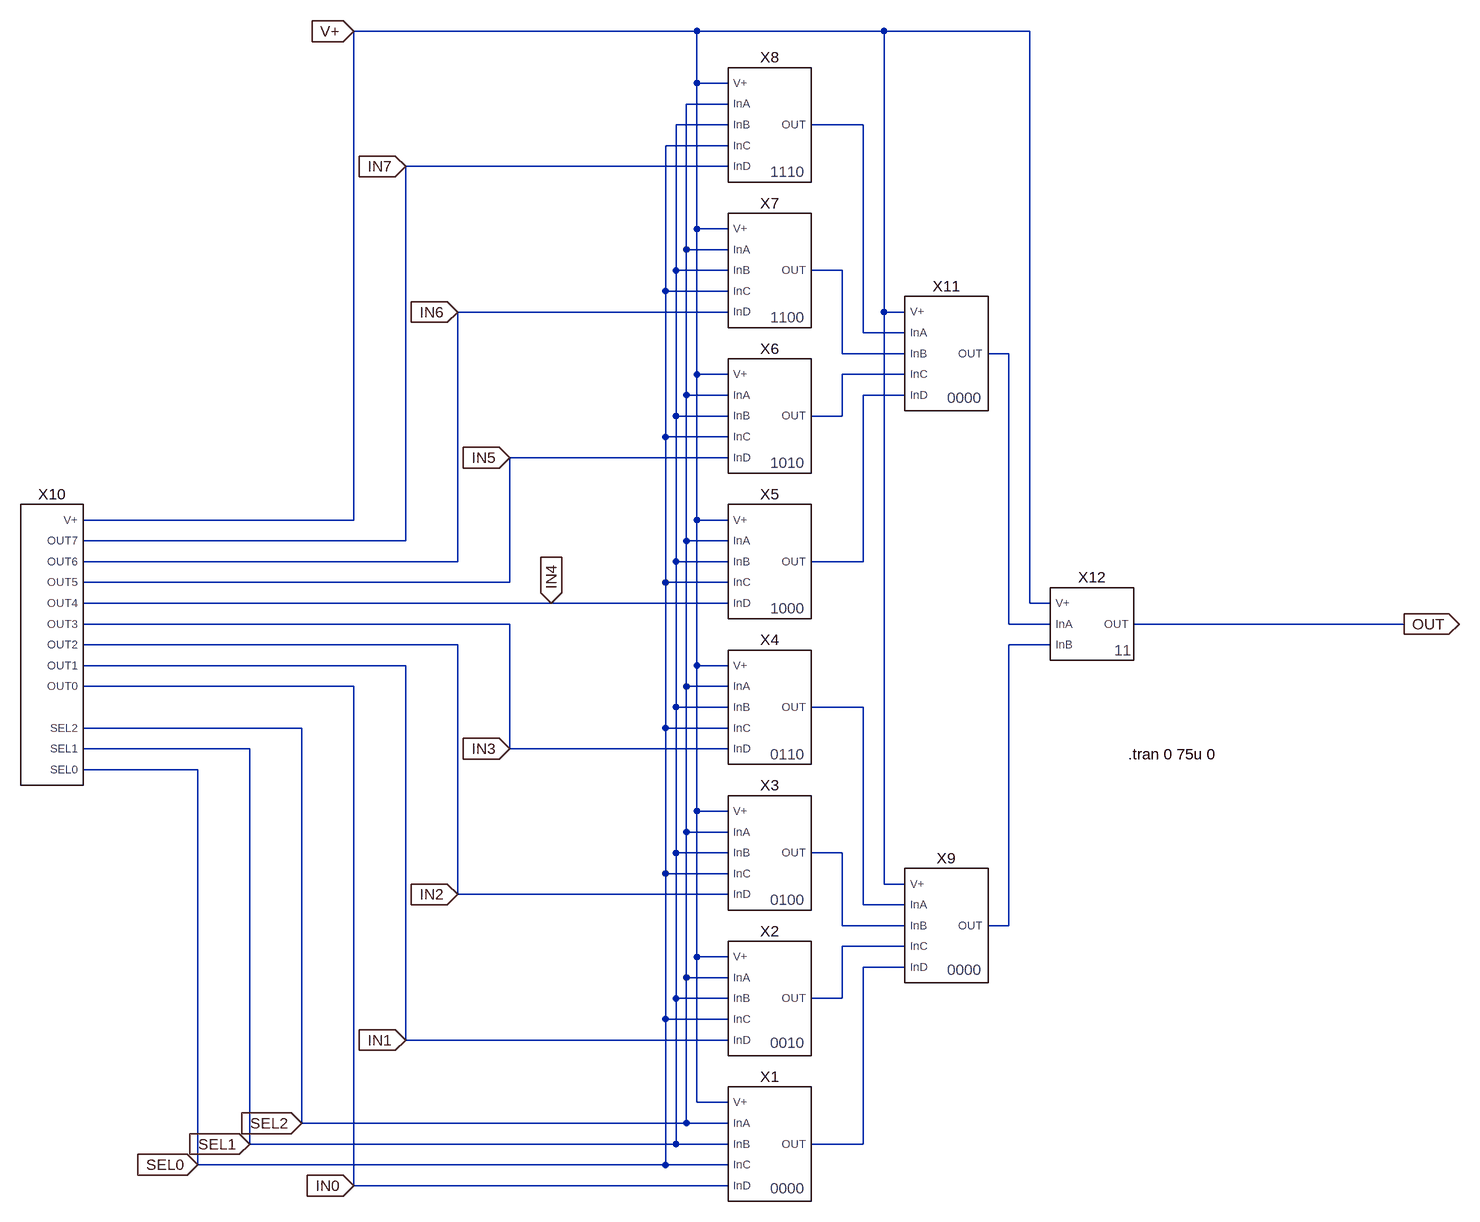
[diagram p0: schematic LUT-STIM.asc]
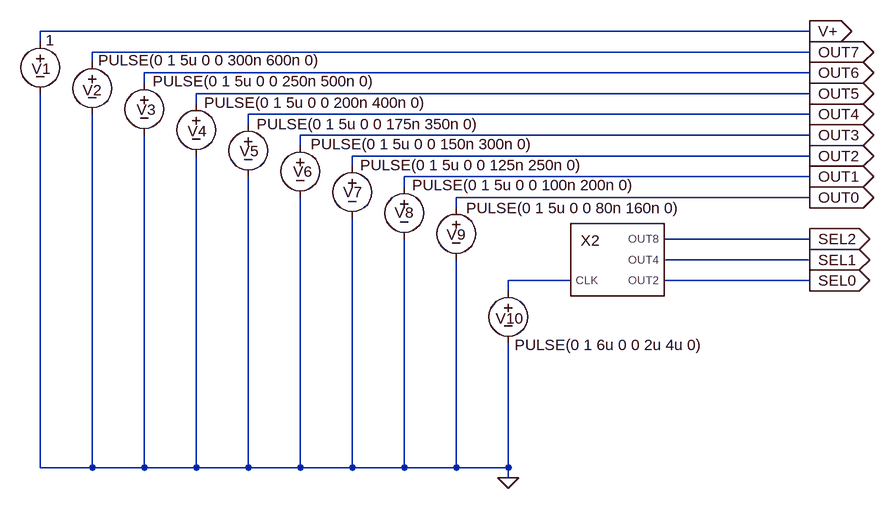
[diagram p1: sub-circuit stim.asc]
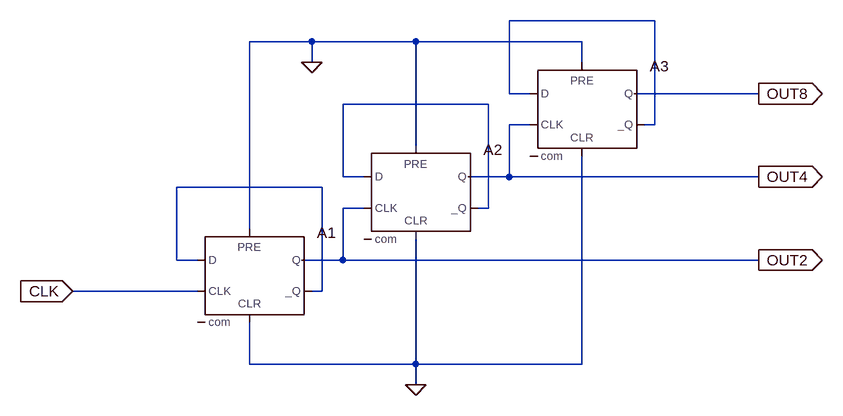
[diagram p2: sub-circuit div.asc]
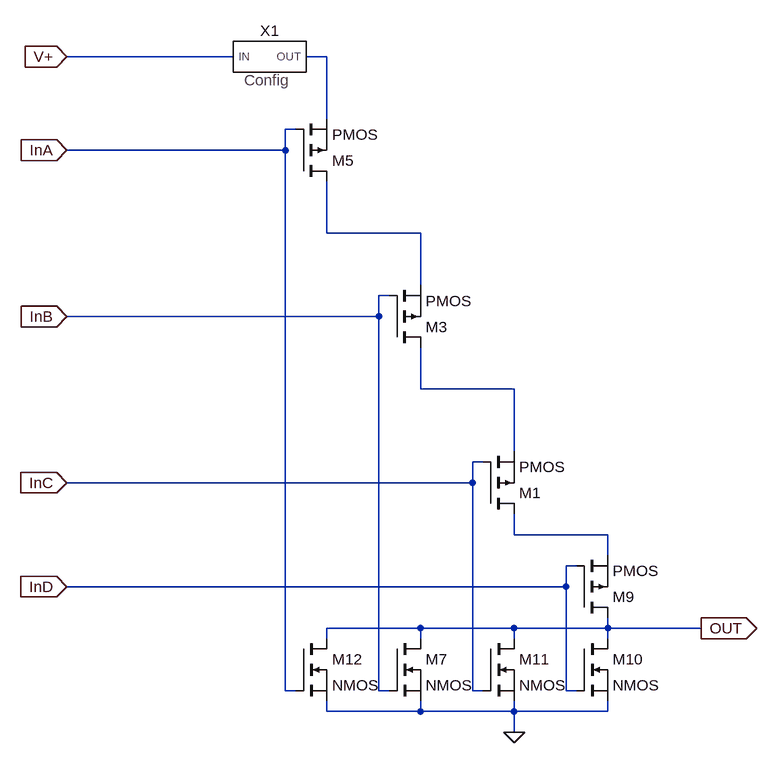
[diagram p3: sub-circuit 4-in-lut-0000.asc]
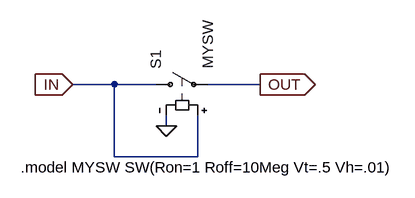
[diagram p4: sub-circuit config.asc]
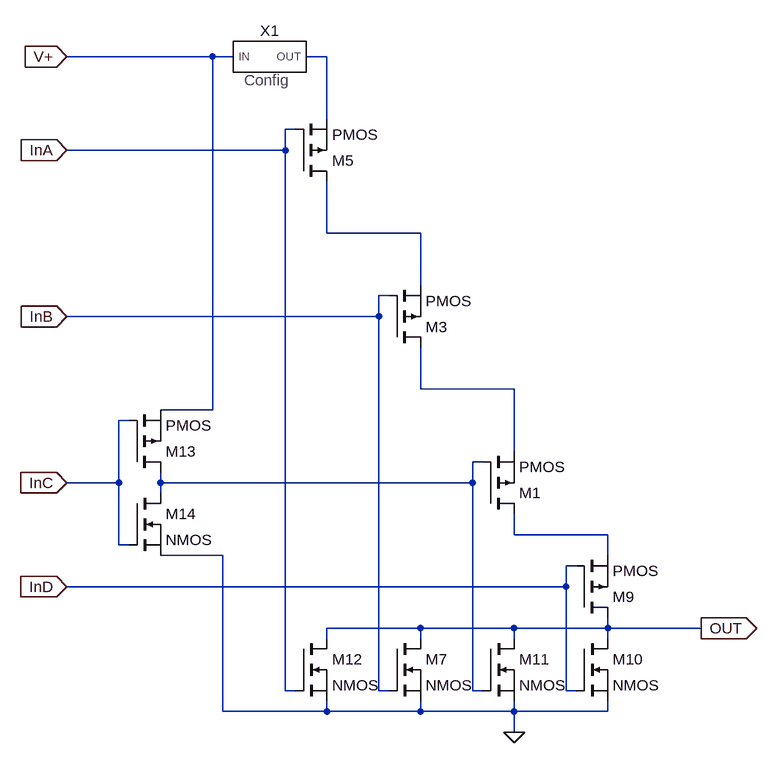
[diagram p5: sub-circuit 4-in-lut-0010.asc]
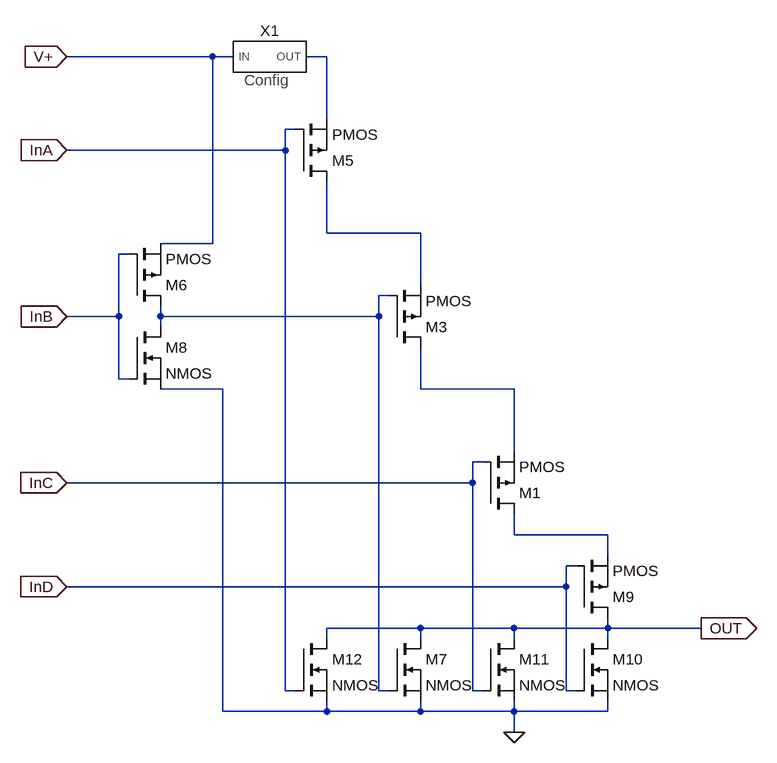
[diagram p6: sub-circuit 4-in-lut-0100.asc]
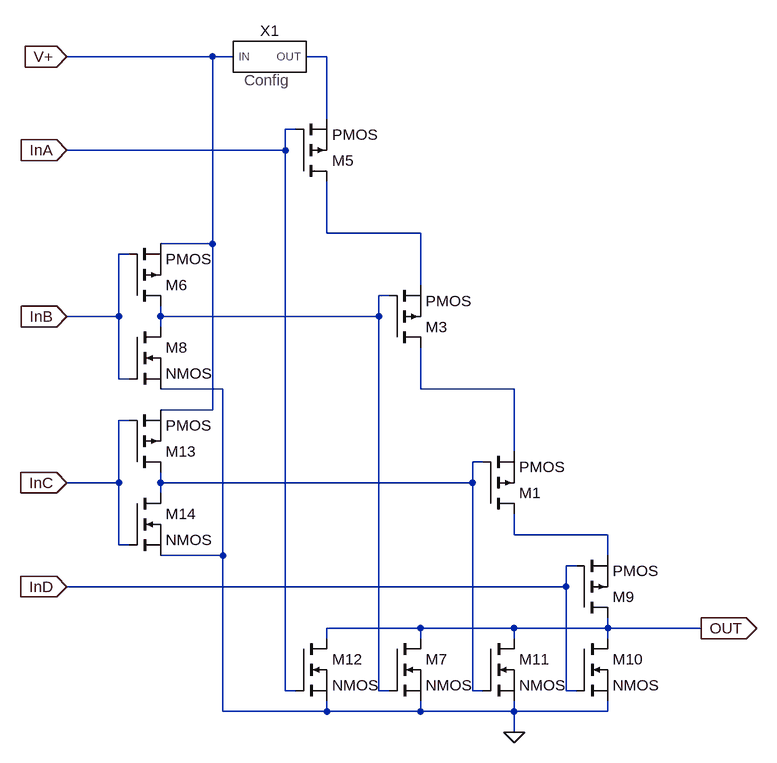
[diagram p7: sub-circuit 4-in-lut-0110.asc]
LUT-STIM.asc, the LTspice schematic file:
Version 4
SHEET 1 1292 768
WIRE -32 -1072 -560 -1072
WIRE 256 -1072 -32 -1072
WIRE 480 -1072 256 -1072
WIRE -32 -992 -32 -1072
WIRE 16 -992 -32 -992
WIRE 16 -960 -48 -960
WIRE 16 -928 -64 -928
WIRE 224 -928 144 -928
WIRE 16 -896 -80 -896
WIRE 16 -864 -480 -864
WIRE -32 -768 -32 -992
WIRE 16 -768 -32 -768
WIRE -48 -736 -48 -960
WIRE 16 -736 -48 -736
WIRE -64 -704 -64 -928
WIRE 16 -704 -64 -704
WIRE 192 -704 144 -704
WIRE -80 -672 -80 -896
WIRE 16 -672 -80 -672
WIRE 16 -640 -400 -640
WIRE 256 -640 256 -1072
WIRE 288 -640 256 -640
WIRE 224 -608 224 -928
WIRE 288 -608 224 -608
WIRE 192 -576 192 -704
WIRE 288 -576 192 -576
WIRE 448 -576 416 -576
WIRE -32 -544 -32 -768
WIRE 16 -544 -32 -544
WIRE 288 -544 192 -544
WIRE -48 -512 -48 -736
WIRE 16 -512 -48 -512
WIRE 288 -512 224 -512
WIRE -64 -480 -64 -704
WIRE 16 -480 -64 -480
WIRE 192 -480 192 -544
WIRE 192 -480 144 -480
WIRE -80 -448 -80 -672
WIRE 16 -448 -80 -448
WIRE 16 -416 -320 -416
WIRE -560 -320 -560 -1072
WIRE -560 -320 -976 -320
WIRE -32 -320 -32 -544
WIRE 16 -320 -32 -320
WIRE -480 -288 -480 -864
WIRE -480 -288 -976 -288
WIRE -48 -288 -48 -512
WIRE 16 -288 -48 -288
WIRE -400 -256 -400 -640
WIRE -400 -256 -976 -256
WIRE -64 -256 -64 -480
WIRE 16 -256 -64 -256
WIRE 224 -256 224 -512
WIRE 224 -256 144 -256
WIRE -320 -224 -320 -416
WIRE -320 -224 -976 -224
WIRE -80 -224 -80 -448
WIRE 16 -224 -80 -224
WIRE -256 -192 -976 -192
WIRE 16 -192 -256 -192
WIRE 480 -192 480 -1072
WIRE 512 -192 480 -192
WIRE -320 -160 -976 -160
WIRE 448 -160 448 -576
WIRE 512 -160 448 -160
WIRE 1056 -160 640 -160
WIRE -400 -128 -976 -128
WIRE 512 -128 448 -128
WIRE -480 -96 -976 -96
WIRE -32 -96 -32 -320
WIRE 16 -96 -32 -96
WIRE -560 -64 -976 -64
WIRE -48 -64 -48 -288
WIRE 16 -64 -48 -64
WIRE -64 -32 -64 -256
WIRE 16 -32 -64 -32
WIRE 224 -32 144 -32
WIRE -640 0 -976 0
WIRE -80 0 -80 -224
WIRE 16 0 -80 0
WIRE -720 32 -976 32
WIRE -320 32 -320 -160
WIRE 16 32 -320 32
WIRE -800 64 -976 64
WIRE -32 128 -32 -96
WIRE 16 128 -32 128
WIRE -48 160 -48 -64
WIRE 16 160 -48 160
WIRE -64 192 -64 -32
WIRE 16 192 -64 192
WIRE 192 192 144 192
WIRE -80 224 -80 0
WIRE 16 224 -80 224
WIRE 256 240 256 -640
WIRE 288 240 256 240
WIRE -400 256 -400 -128
WIRE 16 256 -400 256
WIRE 224 272 224 -32
WIRE 288 272 224 272
WIRE 192 304 192 192
WIRE 288 304 192 304
WIRE 448 304 448 -128
WIRE 448 304 416 304
WIRE 288 336 192 336
WIRE -32 352 -32 128
WIRE 16 352 -32 352
WIRE 288 368 224 368
WIRE -48 384 -48 160
WIRE 16 384 -48 384
WIRE -64 416 -64 192
WIRE 16 416 -64 416
WIRE 192 416 192 336
WIRE 192 416 144 416
WIRE -80 448 -80 224
WIRE 16 448 -80 448
WIRE -480 480 -480 -96
WIRE 16 480 -480 480
WIRE -32 576 -32 352
WIRE 16 576 -32 576
WIRE -640 608 -640 0
WIRE -48 608 -48 384
WIRE -48 608 -640 608
WIRE 16 608 -48 608
WIRE -720 640 -720 32
WIRE -64 640 -64 416
WIRE -64 640 -720 640
WIRE 16 640 -64 640
WIRE 224 640 224 368
WIRE 224 640 144 640
WIRE -800 672 -800 64
WIRE -80 672 -80 448
WIRE -80 672 -800 672
WIRE 16 672 -80 672
WIRE -560 704 -560 -64
WIRE 16 704 -560 704
FLAG 1056 -160 OUT
IOPIN 1056 -160 Out
FLAG -560 -1072 V+
IOPIN -560 -1072 In
FLAG -480 -864 IN7
IOPIN -480 -864 In
FLAG -400 -640 IN6
IOPIN -400 -640 In
FLAG -320 -416 IN5
IOPIN -320 -416 In
FLAG -256 -192 IN4
IOPIN -256 -192 In
FLAG -320 32 IN3
IOPIN -320 32 In
FLAG -400 256 IN2
IOPIN -400 256 In
FLAG -480 480 IN1
IOPIN -480 480 In
FLAG -640 608 SEL2
IOPIN -640 608 In
FLAG -720 640 SEL1
IOPIN -720 640 In
FLAG -800 672 SEL0
IOPIN -800 672 In
FLAG -560 704 IN0
IOPIN -560 704 In
SYMBOL STIM -1024 -144 R0
SYMATTR InstName X10
SYMBOL 4-in-LUT-0000 80 640 R0
SYMATTR InstName X1
SYMBOL 4-in-LUT-0010 80 416 R0
SYMATTR InstName X2
SYMBOL 4-in-LUT-0100 80 192 R0
SYMATTR InstName X3
SYMBOL 4-in-LUT-0110 80 -32 R0
SYMATTR InstName X4
SYMBOL 4-in-LUT-1000 80 -256 R0
SYMATTR InstName X5
SYMBOL 4-in-LUT-1010 80 -480 R0
SYMATTR InstName X6
SYMBOL 4-in-LUT-1100 80 -704 R0
SYMATTR InstName X7
SYMBOL 4-in-LUT-1110 80 -928 R0
SYMATTR InstName X8
SYMBOL 4-in-LUT-0000 352 304 R0
SYMATTR InstName X9
SYMBOL 4-in-LUT-0000 352 -576 R0
SYMATTR InstName X11
SYMBOL 2-in-LUT-11 576 -160 R0
SYMATTR InstName X12
TEXT 632 40 Left 2 !.tran 0 75u 0

stim.asc, the sub-circuit schematic file:
Version 4
SHEET 1 1544 784
WIRE 1040 80 -144 80
WIRE -144 96 -144 80
WIRE 1040 112 -64 112
WIRE -64 128 -64 112
WIRE 1040 144 16 144
WIRE 16 160 16 144
WIRE 1040 176 96 176
WIRE 96 192 96 176
WIRE 1040 208 176 208
WIRE 176 224 176 208
WIRE 1040 240 256 240
WIRE 256 256 256 240
WIRE 1040 272 336 272
WIRE 336 288 336 272
WIRE 1040 304 416 304
WIRE 416 320 416 304
WIRE 1040 336 496 336
WIRE 496 352 496 336
WIRE 1040 400 816 400
WIRE 1040 432 816 432
WIRE 672 464 576 464
WIRE 1040 464 816 464
WIRE 576 480 576 464
WIRE -144 752 -144 176
WIRE -64 752 -64 208
WIRE -64 752 -144 752
WIRE 16 752 16 240
WIRE 16 752 -64 752
WIRE 96 752 96 272
WIRE 96 752 16 752
WIRE 176 752 176 304
WIRE 176 752 96 752
WIRE 256 752 256 336
WIRE 256 752 176 752
WIRE 336 752 336 368
WIRE 336 752 256 752
WIRE 416 752 416 400
WIRE 416 752 336 752
WIRE 496 752 496 432
WIRE 496 752 416 752
WIRE 576 752 576 560
WIRE 576 752 496 752
WIRE 576 768 576 752
FLAG 576 768 0
FLAG 1040 80 V+
IOPIN 1040 80 Out
FLAG 1040 112 OUT7
IOPIN 1040 112 Out
FLAG 1040 144 OUT6
IOPIN 1040 144 Out
FLAG 1040 176 OUT5
IOPIN 1040 176 Out
FLAG 1040 208 OUT4
IOPIN 1040 208 Out
FLAG 1040 240 OUT3
IOPIN 1040 240 Out
FLAG 1040 272 OUT2
IOPIN 1040 272 Out
FLAG 1040 304 OUT1
IOPIN 1040 304 Out
FLAG 1040 336 OUT0
IOPIN 1040 336 Out
FLAG 1040 400 SEL2
IOPIN 1040 400 Out
FLAG 1040 432 SEL1
IOPIN 1040 432 Out
FLAG 1040 464 SEL0
IOPIN 1040 464 Out
SYMBOL voltage -144 80 R0
WINDOW 0 -13 58 Left 2
WINDOW 3 8 14 Left 2
SYMATTR InstName V1
SYMATTR Value 1
SYMBOL voltage -64 112 R0
WINDOW 0 -15 59 Left 2
WINDOW 3 9 13 Left 2
SYMATTR InstName V2
SYMATTR Value PULSE(0 1 5u 0 0 300n 600n 0)
SYMBOL voltage 16 144 R0
WINDOW 0 -12 57 Left 2
WINDOW 3 13 13 Left 2
SYMATTR InstName V3
SYMATTR Value PULSE(0 1 5u 0 0 250n 500n 0)
SYMBOL voltage 96 176 R0
WINDOW 0 -13 58 Left 2
WINDOW 3 12 14 Left 2
SYMATTR InstName V4
SYMATTR Value PULSE(0 1 5u 0 0 200n 400n 0)
SYMBOL voltage 176 208 R0
WINDOW 0 -13 57 Left 2
WINDOW 3 13 15 Left 2
SYMATTR InstName V5
SYMATTR Value PULSE(0 1 5u 0 0 175n 350n 0)
SYMBOL voltage 256 240 R0
WINDOW 0 -11 56 Left 2
WINDOW 3 16 14 Left 2
SYMATTR InstName V6
SYMATTR Value PULSE(0 1 5u 0 0 150n 300n 0)
SYMBOL voltage 336 272 R0
WINDOW 0 -14 56 Left 2
WINDOW 3 12 14 Left 2
SYMATTR InstName V7
SYMATTR Value PULSE(0 1 5u 0 0 125n 250n 0)
SYMBOL voltage 416 304 R0
WINDOW 0 -15 55 Left 2
WINDOW 3 12 13 Left 2
SYMATTR InstName V8
SYMATTR Value PULSE(0 1 5u 0 0 100n 200n 0)
SYMBOL voltage 496 336 R0
WINDOW 0 -15 57 Left 2
WINDOW 3 15 16 Left 2
SYMATTR InstName V9
SYMATTR Value PULSE(0 1 5u 0 0 80n 160n 0)
SYMBOL voltage 576 464 R0
WINDOW 0 -19 58 Left 2
WINDOW 3 10 99 Left 2
SYMATTR InstName V10
SYMATTR Value PULSE(0 1 6u 0 0 2u 4u 0)
SYMBOL DIV 736 432 R0
WINDOW 0 -34 -14 Bottom 2
SYMATTR InstName X2

div.asc, the sub-circuit schematic file:
Version 4
SHEET 1 1116 760
WIRE 848 -128 624 -128
WIRE 320 -96 224 -96
WIRE 480 -96 320 -96
WIRE 736 -96 480 -96
WIRE 320 -64 320 -96
WIRE 736 -64 736 -96
WIRE 624 -16 624 -128
WIRE 656 -16 624 -16
WIRE 1008 -16 816 -16
WIRE 592 0 368 0
WIRE 656 32 624 32
WIRE 848 32 848 -128
WIRE 848 32 832 32
WIRE 480 64 480 -96
WIRE 368 112 368 0
WIRE 400 112 368 112
WIRE 624 112 624 32
WIRE 624 112 560 112
WIRE 1008 112 624 112
WIRE 336 128 112 128
WIRE 400 160 368 160
WIRE 592 160 592 0
WIRE 592 160 576 160
WIRE 224 192 224 -96
WIRE 112 240 112 128
WIRE 144 240 112 240
WIRE 368 240 368 160
WIRE 368 240 304 240
WIRE 1008 240 368 240
WIRE 144 288 -48 288
WIRE 336 288 336 128
WIRE 336 288 320 288
WIRE 224 400 224 336
WIRE 480 400 480 208
WIRE 480 400 224 400
WIRE 736 400 736 80
WIRE 736 400 480 400
WIRE 480 432 480 400
FLAG 480 432 0
FLAG -48 288 CLK
IOPIN -48 288 In
FLAG 1008 240 OUT2
IOPIN 1008 240 Out
FLAG 1008 112 OUT4
IOPIN 1008 112 Out
FLAG 1008 -16 OUT8
IOPIN 1008 -16 Out
FLAG 320 -64 0
SYMBOL Digital/dflop 224 192 R0
SYMATTR InstName A1
SYMBOL Digital/dflop 480 64 R0
SYMATTR InstName A2
SYMBOL Digital/dflop 736 -64 R0
SYMATTR InstName A3

4-in-lut-0000.asc, the sub-circuit schematic file:
Version 4
SHEET 1 1660 728
WIRE 464 -688 208 -688
WIRE 608 -688 576 -688
WIRE 608 -592 608 -688
WIRE 560 -576 544 -576
WIRE 544 -544 208 -544
WIRE 544 -544 544 -576
WIRE 608 -416 608 -496
WIRE 752 -416 608 -416
WIRE 752 -336 752 -416
WIRE 704 -320 688 -320
WIRE 688 -288 688 -320
WIRE 688 -288 208 -288
WIRE 752 -176 752 -240
WIRE 896 -176 752 -176
WIRE 896 -80 896 -176
WIRE 848 -64 832 -64
WIRE 832 -32 832 -64
WIRE 832 -32 208 -32
WIRE 896 48 896 16
WIRE 1040 48 896 48
WIRE 1040 80 1040 48
WIRE 992 96 976 96
WIRE 976 128 976 96
WIRE 976 128 208 128
WIRE 752 192 608 192
WIRE 896 192 752 192
WIRE 1040 192 1040 176
WIRE 1040 192 896 192
WIRE 1184 192 1040 192
WIRE 608 208 608 192
WIRE 752 208 752 192
WIRE 896 208 896 192
WIRE 1040 208 1040 192
WIRE 544 288 544 -544
WIRE 560 288 544 288
WIRE 688 288 688 -288
WIRE 704 288 688 288
WIRE 832 288 832 -32
WIRE 848 288 832 288
WIRE 976 288 976 128
WIRE 992 288 976 288
WIRE 608 320 608 304
WIRE 752 320 752 304
WIRE 752 320 608 320
WIRE 896 320 896 304
WIRE 896 320 752 320
WIRE 1040 320 1040 304
WIRE 1040 320 896 320
WIRE 896 352 896 320
FLAG 896 352 0
FLAG 1184 192 OUT
IOPIN 1184 192 Out
FLAG 208 -688 V+
IOPIN 208 -688 In
FLAG 208 -544 InA
IOPIN 208 -544 In
FLAG 208 -288 InB
IOPIN 208 -288 In
FLAG 208 -32 InC
IOPIN 208 -32 In
FLAG 208 128 InD
IOPIN 208 128 In
SYMBOL pmos 992 176 M180
SYMATTR InstName M9
SYMBOL pmos 848 16 M180
SYMATTR InstName M1
SYMBOL pmos 704 -240 M180
SYMATTR InstName M3
SYMBOL pmos 560 -496 M180
SYMATTR InstName M5
SYMBOL nmos 704 208 R0
SYMATTR InstName M7
SYMBOL nmos 992 208 R0
SYMATTR InstName M10
SYMBOL nmos 848 208 R0
SYMATTR InstName M11
SYMBOL nmos 560 208 R0
SYMATTR InstName M12
SYMBOL Config 512 -688 R0
SYMATTR InstName X1

config.asc, the sub-circuit schematic file:
Version 4
SHEET 1 880 680
WIRE 208 192 144 192
WIRE 272 192 208 192
WIRE 432 192 352 192
WIRE 288 256 288 240
WIRE 208 304 208 192
WIRE 336 304 336 240
WIRE 336 304 208 304
FLAG 432 192 OUT
IOPIN 432 192 Out
FLAG 144 192 IN
IOPIN 144 192 In
FLAG 288 256 0
SYMBOL sw 256 192 R270
SYMATTR InstName S1
SYMATTR Value MYSW
TEXT 64 320 Left 2 !.model MYSW SW(Ron=1 Roff=10Meg Vt=.5 Vh=.01)

4-in-lut-0010.asc, the sub-circuit schematic file:
Version 4
SHEET 1 1660 728
WIRE 432 -688 208 -688
WIRE 464 -688 432 -688
WIRE 608 -688 576 -688
WIRE 608 -592 608 -688
WIRE 560 -576 544 -576
WIRE 544 -544 544 -576
WIRE 544 -544 208 -544
WIRE 608 -416 608 -496
WIRE 752 -416 608 -416
WIRE 752 -336 752 -416
WIRE 704 -320 688 -320
WIRE 688 -288 688 -320
WIRE 688 -288 208 -288
WIRE 752 -176 752 -240
WIRE 896 -176 752 -176
WIRE 432 -144 432 -688
WIRE 432 -144 352 -144
WIRE 304 -128 288 -128
WIRE 896 -80 896 -176
WIRE 848 -64 832 -64
WIRE 288 -32 288 -128
WIRE 288 -32 208 -32
WIRE 352 -32 352 -48
WIRE 832 -32 832 -64
WIRE 832 -32 352 -32
WIRE 352 -16 352 -32
WIRE 896 48 896 16
WIRE 1040 48 896 48
WIRE 288 64 288 -32
WIRE 304 64 288 64
WIRE 448 80 352 80
WIRE 1040 80 1040 48
WIRE 992 96 976 96
WIRE 976 128 976 96
WIRE 976 128 208 128
WIRE 752 192 608 192
WIRE 896 192 752 192
WIRE 1040 192 1040 176
WIRE 1040 192 896 192
WIRE 1184 192 1040 192
WIRE 608 208 608 192
WIRE 752 208 752 192
WIRE 896 208 896 192
WIRE 1040 208 1040 192
WIRE 544 288 544 -544
WIRE 560 288 544 288
WIRE 688 288 688 -288
WIRE 704 288 688 288
WIRE 832 288 832 -32
WIRE 848 288 832 288
WIRE 976 288 976 128
WIRE 992 288 976 288
WIRE 448 320 448 80
WIRE 608 320 608 304
WIRE 608 320 448 320
WIRE 752 320 752 304
WIRE 752 320 608 320
WIRE 896 320 896 304
WIRE 896 320 752 320
WIRE 1040 320 1040 304
WIRE 1040 320 896 320
WIRE 896 352 896 320
FLAG 896 352 0
FLAG 1184 192 OUT
IOPIN 1184 192 Out
FLAG 208 -688 V+
IOPIN 208 -688 In
FLAG 208 -544 InA
IOPIN 208 -544 In
FLAG 208 -288 InB
IOPIN 208 -288 In
FLAG 208 -32 InC
IOPIN 208 -32 In
FLAG 208 128 InD
IOPIN 208 128 In
SYMBOL pmos 992 176 M180
SYMATTR InstName M9
SYMBOL pmos 848 16 M180
SYMATTR InstName M1
SYMBOL pmos 704 -240 M180
SYMATTR InstName M3
SYMBOL pmos 560 -496 M180
SYMATTR InstName M5
SYMBOL nmos 704 208 R0
SYMATTR InstName M7
SYMBOL nmos 992 208 R0
SYMATTR InstName M10
SYMBOL nmos 848 208 R0
SYMATTR InstName M11
SYMBOL nmos 560 208 R0
SYMATTR InstName M12
SYMBOL Config 512 -688 R0
SYMATTR InstName X1
SYMBOL pmos 304 -48 M180
SYMATTR InstName M13
SYMBOL nmos 304 -16 R0
SYMATTR InstName M14

4-in-lut-0100.asc, the sub-circuit schematic file:
Version 4
SHEET 1 1660 728
WIRE 432 -688 208 -688
WIRE 464 -688 432 -688
WIRE 608 -688 576 -688
WIRE 608 -592 608 -688
WIRE 560 -576 544 -576
WIRE 544 -544 544 -576
WIRE 544 -544 208 -544
WIRE 608 -416 608 -496
WIRE 752 -416 608 -416
WIRE 432 -400 432 -688
WIRE 432 -400 352 -400
WIRE 304 -384 288 -384
WIRE 752 -336 752 -416
WIRE 704 -320 688 -320
WIRE 288 -288 288 -384
WIRE 288 -288 208 -288
WIRE 352 -288 352 -304
WIRE 688 -288 688 -320
WIRE 688 -288 352 -288
WIRE 352 -272 352 -288
WIRE 288 -192 288 -288
WIRE 304 -192 288 -192
WIRE 448 -176 352 -176
WIRE 752 -176 752 -240
WIRE 896 -176 752 -176
WIRE 896 -80 896 -176
WIRE 848 -64 832 -64
WIRE 832 -32 832 -64
WIRE 832 -32 208 -32
WIRE 896 48 896 16
WIRE 1040 48 896 48
WIRE 1040 80 1040 48
WIRE 992 96 976 96
WIRE 976 128 976 96
WIRE 976 128 208 128
WIRE 752 192 608 192
WIRE 896 192 752 192
WIRE 1040 192 1040 176
WIRE 1040 192 896 192
WIRE 1184 192 1040 192
WIRE 608 208 608 192
WIRE 752 208 752 192
WIRE 896 208 896 192
WIRE 1040 208 1040 192
WIRE 544 288 544 -544
WIRE 560 288 544 288
WIRE 688 288 688 -288
WIRE 704 288 688 288
WIRE 832 288 832 -32
WIRE 848 288 832 288
WIRE 976 288 976 128
WIRE 992 288 976 288
WIRE 448 320 448 -176
WIRE 608 320 608 304
WIRE 608 320 448 320
WIRE 752 320 752 304
WIRE 752 320 608 320
WIRE 896 320 896 304
WIRE 896 320 752 320
WIRE 1040 320 1040 304
WIRE 1040 320 896 320
WIRE 896 352 896 320
FLAG 896 352 0
FLAG 1184 192 OUT
IOPIN 1184 192 Out
FLAG 208 -688 V+
IOPIN 208 -688 In
FLAG 208 -544 InA
IOPIN 208 -544 In
FLAG 208 -288 InB
IOPIN 208 -288 In
FLAG 208 -32 InC
IOPIN 208 -32 In
FLAG 208 128 InD
IOPIN 208 128 In
SYMBOL pmos 992 176 M180
SYMATTR InstName M9
SYMBOL pmos 848 16 M180
SYMATTR InstName M1
SYMBOL pmos 704 -240 M180
SYMATTR InstName M3
SYMBOL pmos 560 -496 M180
SYMATTR InstName M5
SYMBOL nmos 704 208 R0
SYMATTR InstName M7
SYMBOL nmos 992 208 R0
SYMATTR InstName M10
SYMBOL nmos 848 208 R0
SYMATTR InstName M11
SYMBOL nmos 560 208 R0
SYMATTR InstName M12
SYMBOL Config 512 -688 R0
SYMATTR InstName X1
SYMBOL pmos 304 -304 M180
SYMATTR InstName M6
SYMBOL nmos 304 -272 R0
SYMATTR InstName M8

4-in-lut-0110.asc, the sub-circuit schematic file:
Version 4
SHEET 1 1660 728
WIRE 432 -688 208 -688
WIRE 464 -688 432 -688
WIRE 608 -688 576 -688
WIRE 608 -592 608 -688
WIRE 560 -576 544 -576
WIRE 544 -544 544 -576
WIRE 544 -544 208 -544
WIRE 608 -416 608 -496
WIRE 752 -416 608 -416
WIRE 432 -400 432 -688
WIRE 432 -400 352 -400
WIRE 304 -384 288 -384
WIRE 752 -336 752 -416
WIRE 704 -320 688 -320
WIRE 288 -288 288 -384
WIRE 288 -288 208 -288
WIRE 352 -288 352 -304
WIRE 688 -288 688 -320
WIRE 688 -288 352 -288
WIRE 352 -272 352 -288
WIRE 288 -192 288 -288
WIRE 304 -192 288 -192
WIRE 448 -176 352 -176
WIRE 752 -176 752 -240
WIRE 896 -176 752 -176
WIRE 432 -144 432 -400
WIRE 432 -144 352 -144
WIRE 304 -128 288 -128
WIRE 896 -80 896 -176
WIRE 848 -64 832 -64
WIRE 288 -32 288 -128
WIRE 288 -32 208 -32
WIRE 352 -32 352 -48
WIRE 832 -32 832 -64
WIRE 832 -32 352 -32
WIRE 352 -16 352 -32
WIRE 896 48 896 16
WIRE 1040 48 896 48
WIRE 288 64 288 -32
WIRE 304 64 288 64
WIRE 448 80 448 -176
WIRE 448 80 352 80
WIRE 1040 80 1040 48
WIRE 992 96 976 96
WIRE 976 128 976 96
WIRE 976 128 208 128
WIRE 752 192 608 192
WIRE 896 192 752 192
WIRE 1040 192 1040 176
WIRE 1040 192 896 192
WIRE 1184 192 1040 192
WIRE 608 208 608 192
WIRE 752 208 752 192
WIRE 896 208 896 192
WIRE 1040 208 1040 192
WIRE 544 288 544 -544
WIRE 560 288 544 288
WIRE 688 288 688 -288
WIRE 704 288 688 288
WIRE 832 288 832 -32
WIRE 848 288 832 288
WIRE 976 288 976 128
WIRE 992 288 976 288
WIRE 448 320 448 80
WIRE 608 320 608 304
WIRE 608 320 448 320
WIRE 752 320 752 304
WIRE 752 320 608 320
WIRE 896 320 896 304
WIRE 896 320 752 320
WIRE 1040 320 1040 304
WIRE 1040 320 896 320
WIRE 896 352 896 320
FLAG 896 352 0
FLAG 1184 192 OUT
IOPIN 1184 192 Out
FLAG 208 -688 V+
IOPIN 208 -688 In
FLAG 208 -544 InA
IOPIN 208 -544 In
FLAG 208 -288 InB
IOPIN 208 -288 In
FLAG 208 -32 InC
IOPIN 208 -32 In
FLAG 208 128 InD
IOPIN 208 128 In
SYMBOL pmos 992 176 M180
SYMATTR InstName M9
SYMBOL pmos 848 16 M180
SYMATTR InstName M1
SYMBOL pmos 704 -240 M180
SYMATTR InstName M3
SYMBOL pmos 560 -496 M180
SYMATTR InstName M5
SYMBOL nmos 704 208 R0
SYMATTR InstName M7
SYMBOL nmos 992 208 R0
SYMATTR InstName M10
SYMBOL nmos 848 208 R0
SYMATTR InstName M11
SYMBOL nmos 560 208 R0
SYMATTR InstName M12
SYMBOL Config 512 -688 R0
SYMATTR InstName X1
SYMBOL pmos 304 -304 M180
SYMATTR InstName M6
SYMBOL nmos 304 -272 R0
SYMATTR InstName M8
SYMBOL pmos 304 -48 M180
SYMATTR InstName M13
SYMBOL nmos 304 -16 R0
SYMATTR InstName M14

4-in-lut-1000.asc, the sub-circuit schematic file:
Version 4
SHEET 1 1660 728
WIRE 432 -688 208 -688
WIRE 464 -688 432 -688
WIRE 608 -688 576 -688
WIRE 432 -656 432 -688
WIRE 432 -656 352 -656
WIRE 304 -640 288 -640
WIRE 608 -592 608 -688
WIRE 560 -576 544 -576
WIRE 288 -544 288 -640
WIRE 288 -544 208 -544
WIRE 352 -544 352 -560
WIRE 544 -544 544 -576
WIRE 544 -544 352 -544
WIRE 352 -528 352 -544
WIRE 288 -448 288 -544
WIRE 304 -448 288 -448
WIRE 448 -432 352 -432
WIRE 608 -416 608 -496
WIRE 752 -416 608 -416
WIRE 752 -336 752 -416
WIRE 704 -320 688 -320
WIRE 688 -288 688 -320
WIRE 688 -288 208 -288
WIRE 752 -176 752 -240
WIRE 896 -176 752 -176
WIRE 896 -80 896 -176
WIRE 848 -64 832 -64
WIRE 832 -32 832 -64
WIRE 832 -32 208 -32
WIRE 896 48 896 16
WIRE 1040 48 896 48
WIRE 1040 80 1040 48
WIRE 992 96 976 96
WIRE 976 128 976 96
WIRE 976 128 208 128
WIRE 752 192 608 192
WIRE 896 192 752 192
WIRE 1040 192 1040 176
WIRE 1040 192 896 192
WIRE 1184 192 1040 192
WIRE 608 208 608 192
WIRE 752 208 752 192
WIRE 896 208 896 192
WIRE 1040 208 1040 192
WIRE 544 288 544 -544
WIRE 560 288 544 288
WIRE 688 288 688 -288
WIRE 704 288 688 288
WIRE 832 288 832 -32
WIRE 848 288 832 288
WIRE 976 288 976 128
WIRE 992 288 976 288
WIRE 448 320 448 -432
WIRE 608 320 608 304
WIRE 608 320 448 320
WIRE 752 320 752 304
WIRE 752 320 608 320
WIRE 896 320 896 304
WIRE 896 320 752 320
WIRE 1040 320 1040 304
WIRE 1040 320 896 320
WIRE 896 352 896 320
FLAG 896 352 0
FLAG 1184 192 OUT
IOPIN 1184 192 Out
FLAG 208 -688 V+
IOPIN 208 -688 In
FLAG 208 -544 InA
IOPIN 208 -544 In
FLAG 208 -288 InB
IOPIN 208 -288 In
FLAG 208 -32 InC
IOPIN 208 -32 In
FLAG 208 128 InD
IOPIN 208 128 In
SYMBOL pmos 992 176 M180
SYMATTR InstName M9
SYMBOL pmos 848 16 M180
SYMATTR InstName M1
SYMBOL pmos 704 -240 M180
SYMATTR InstName M3
SYMBOL pmos 560 -496 M180
SYMATTR InstName M5
SYMBOL nmos 704 208 R0
SYMATTR InstName M7
SYMBOL nmos 992 208 R0
SYMATTR InstName M10
SYMBOL nmos 848 208 R0
SYMATTR InstName M11
SYMBOL nmos 560 208 R0
SYMATTR InstName M12
SYMBOL Config 512 -688 R0
SYMATTR InstName X1
SYMBOL pmos 304 -560 M180
SYMATTR InstName M2
SYMBOL nmos 304 -528 R0
SYMATTR InstName M4

4-in-lut-1010.asc, the sub-circuit schematic file:
Version 4
SHEET 1 1660 728
WIRE 432 -688 208 -688
WIRE 464 -688 432 -688
WIRE 608 -688 576 -688
WIRE 432 -656 432 -688
WIRE 432 -656 352 -656
WIRE 304 -640 288 -640
WIRE 608 -592 608 -688
WIRE 560 -576 544 -576
WIRE 288 -544 288 -640
WIRE 288 -544 208 -544
WIRE 352 -544 352 -560
WIRE 544 -544 544 -576
WIRE 544 -544 352 -544
WIRE 352 -528 352 -544
WIRE 288 -448 288 -544
WIRE 304 -448 288 -448
WIRE 448 -432 352 -432
WIRE 608 -416 608 -496
WIRE 752 -416 608 -416
WIRE 752 -336 752 -416
WIRE 704 -320 688 -320
WIRE 688 -288 688 -320
WIRE 688 -288 208 -288
WIRE 752 -176 752 -240
WIRE 896 -176 752 -176
WIRE 432 -144 432 -656
WIRE 432 -144 352 -144
WIRE 304 -128 288 -128
WIRE 896 -80 896 -176
WIRE 848 -64 832 -64
WIRE 288 -32 288 -128
WIRE 288 -32 208 -32
WIRE 352 -32 352 -48
WIRE 832 -32 832 -64
WIRE 832 -32 352 -32
WIRE 352 -16 352 -32
WIRE 896 48 896 16
WIRE 1040 48 896 48
WIRE 288 64 288 -32
WIRE 304 64 288 64
WIRE 448 80 448 -432
WIRE 448 80 352 80
WIRE 1040 80 1040 48
WIRE 992 96 976 96
WIRE 976 128 976 96
WIRE 976 128 208 128
WIRE 752 192 608 192
WIRE 896 192 752 192
WIRE 1040 192 1040 176
WIRE 1040 192 896 192
WIRE 1184 192 1040 192
WIRE 608 208 608 192
WIRE 752 208 752 192
WIRE 896 208 896 192
WIRE 1040 208 1040 192
WIRE 544 288 544 -544
WIRE 560 288 544 288
WIRE 688 288 688 -288
WIRE 704 288 688 288
WIRE 832 288 832 -32
WIRE 848 288 832 288
WIRE 976 288 976 128
WIRE 992 288 976 288
WIRE 448 320 448 80
WIRE 608 320 608 304
WIRE 608 320 448 320
WIRE 752 320 752 304
WIRE 752 320 608 320
WIRE 896 320 896 304
WIRE 896 320 752 320
WIRE 1040 320 1040 304
WIRE 1040 320 896 320
WIRE 896 352 896 320
FLAG 896 352 0
FLAG 1184 192 OUT
IOPIN 1184 192 Out
FLAG 208 -688 V+
IOPIN 208 -688 In
FLAG 208 -544 InA
IOPIN 208 -544 In
FLAG 208 -288 InB
IOPIN 208 -288 In
FLAG 208 -32 InC
IOPIN 208 -32 In
FLAG 208 128 InD
IOPIN 208 128 In
SYMBOL pmos 992 176 M180
SYMATTR InstName M9
SYMBOL pmos 848 16 M180
SYMATTR InstName M1
SYMBOL pmos 704 -240 M180
SYMATTR InstName M3
SYMBOL pmos 560 -496 M180
SYMATTR InstName M5
SYMBOL nmos 704 208 R0
SYMATTR InstName M7
SYMBOL nmos 992 208 R0
SYMATTR InstName M10
SYMBOL nmos 848 208 R0
SYMATTR InstName M11
SYMBOL nmos 560 208 R0
SYMATTR InstName M12
SYMBOL Config 512 -688 R0
SYMATTR InstName X1
SYMBOL pmos 304 -560 M180
SYMATTR InstName M2
SYMBOL nmos 304 -528 R0
SYMATTR InstName M4
SYMBOL pmos 304 -48 M180
SYMATTR InstName M13
SYMBOL nmos 304 -16 R0
SYMATTR InstName M14

4-in-lut-1100.asc, the sub-circuit schematic file:
Version 4
SHEET 1 1660 728
WIRE 432 -688 208 -688
WIRE 464 -688 432 -688
WIRE 608 -688 576 -688
WIRE 432 -656 432 -688
WIRE 432 -656 352 -656
WIRE 304 -640 288 -640
WIRE 608 -592 608 -688
WIRE 560 -576 544 -576
WIRE 288 -544 288 -640
WIRE 288 -544 208 -544
WIRE 352 -544 352 -560
WIRE 544 -544 544 -576
WIRE 544 -544 352 -544
WIRE 352 -528 352 -544
WIRE 288 -448 288 -544
WIRE 304 -448 288 -448
WIRE 448 -432 352 -432
WIRE 608 -416 608 -496
WIRE 752 -416 608 -416
WIRE 432 -400 432 -656
WIRE 432 -400 352 -400
WIRE 304 -384 288 -384
WIRE 752 -336 752 -416
WIRE 704 -320 688 -320
WIRE 288 -288 288 -384
WIRE 288 -288 208 -288
WIRE 352 -288 352 -304
WIRE 688 -288 688 -320
WIRE 688 -288 352 -288
WIRE 352 -272 352 -288
WIRE 288 -192 288 -288
WIRE 304 -192 288 -192
WIRE 448 -176 448 -432
WIRE 448 -176 352 -176
WIRE 752 -176 752 -240
WIRE 896 -176 752 -176
WIRE 896 -80 896 -176
WIRE 848 -64 832 -64
WIRE 832 -32 832 -64
WIRE 832 -32 208 -32
WIRE 896 48 896 16
WIRE 1040 48 896 48
WIRE 1040 80 1040 48
WIRE 992 96 976 96
WIRE 976 128 976 96
WIRE 976 128 208 128
WIRE 752 192 608 192
WIRE 896 192 752 192
WIRE 1040 192 1040 176
WIRE 1040 192 896 192
WIRE 1184 192 1040 192
WIRE 608 208 608 192
WIRE 752 208 752 192
WIRE 896 208 896 192
WIRE 1040 208 1040 192
WIRE 544 288 544 -544
WIRE 560 288 544 288
WIRE 688 288 688 -288
WIRE 704 288 688 288
WIRE 832 288 832 -32
WIRE 848 288 832 288
WIRE 976 288 976 128
WIRE 992 288 976 288
WIRE 448 320 448 -176
WIRE 608 320 608 304
WIRE 608 320 448 320
WIRE 752 320 752 304
WIRE 752 320 608 320
WIRE 896 320 896 304
WIRE 896 320 752 320
WIRE 1040 320 1040 304
WIRE 1040 320 896 320
WIRE 896 352 896 320
FLAG 896 352 0
FLAG 1184 192 OUT
IOPIN 1184 192 Out
FLAG 208 -688 V+
IOPIN 208 -688 In
FLAG 208 -544 InA
IOPIN 208 -544 In
FLAG 208 -288 InB
IOPIN 208 -288 In
FLAG 208 -32 InC
IOPIN 208 -32 In
FLAG 208 128 InD
IOPIN 208 128 In
SYMBOL pmos 992 176 M180
SYMATTR InstName M9
SYMBOL pmos 848 16 M180
SYMATTR InstName M1
SYMBOL pmos 704 -240 M180
SYMATTR InstName M3
SYMBOL pmos 560 -496 M180
SYMATTR InstName M5
SYMBOL nmos 704 208 R0
SYMATTR InstName M7
SYMBOL nmos 992 208 R0
SYMATTR InstName M10
SYMBOL nmos 848 208 R0
SYMATTR InstName M11
SYMBOL nmos 560 208 R0
SYMATTR InstName M12
SYMBOL Config 512 -688 R0
SYMATTR InstName X1
SYMBOL pmos 304 -560 M180
SYMATTR InstName M2
SYMBOL nmos 304 -528 R0
SYMATTR InstName M4
SYMBOL pmos 304 -304 M180
SYMATTR InstName M6
SYMBOL nmos 304 -272 R0
SYMATTR InstName M8

4-in-lut-1110.asc, the sub-circuit schematic file:
Version 4
SHEET 1 1660 728
WIRE 432 -688 208 -688
WIRE 464 -688 432 -688
WIRE 608 -688 576 -688
WIRE 432 -656 432 -688
WIRE 432 -656 352 -656
WIRE 304 -640 288 -640
WIRE 608 -592 608 -688
WIRE 560 -576 544 -576
WIRE 288 -544 288 -640
WIRE 288 -544 208 -544
WIRE 352 -544 352 -560
WIRE 544 -544 544 -576
WIRE 544 -544 352 -544
WIRE 352 -528 352 -544
WIRE 288 -448 288 -544
WIRE 304 -448 288 -448
WIRE 448 -432 352 -432
WIRE 608 -416 608 -496
WIRE 752 -416 608 -416
WIRE 432 -400 432 -656
WIRE 432 -400 352 -400
WIRE 304 -384 288 -384
WIRE 752 -336 752 -416
WIRE 704 -320 688 -320
WIRE 288 -288 288 -384
WIRE 288 -288 208 -288
WIRE 352 -288 352 -304
WIRE 688 -288 688 -320
WIRE 688 -288 352 -288
WIRE 352 -272 352 -288
WIRE 288 -192 288 -288
WIRE 304 -192 288 -192
WIRE 448 -176 448 -432
WIRE 448 -176 352 -176
WIRE 752 -176 752 -240
WIRE 896 -176 752 -176
WIRE 432 -144 432 -400
WIRE 432 -144 352 -144
WIRE 304 -128 288 -128
WIRE 896 -80 896 -176
WIRE 848 -64 832 -64
WIRE 288 -32 288 -128
WIRE 288 -32 208 -32
WIRE 352 -32 352 -48
WIRE 832 -32 832 -64
WIRE 832 -32 352 -32
WIRE 352 -16 352 -32
WIRE 896 48 896 16
WIRE 1040 48 896 48
WIRE 288 64 288 -32
WIRE 304 64 288 64
WIRE 448 80 448 -176
WIRE 448 80 352 80
WIRE 1040 80 1040 48
WIRE 992 96 976 96
WIRE 976 128 976 96
WIRE 976 128 208 128
WIRE 752 192 608 192
WIRE 896 192 752 192
WIRE 1040 192 1040 176
WIRE 1040 192 896 192
WIRE 1184 192 1040 192
WIRE 608 208 608 192
WIRE 752 208 752 192
WIRE 896 208 896 192
WIRE 1040 208 1040 192
WIRE 544 288 544 -544
WIRE 560 288 544 288
WIRE 688 288 688 -288
WIRE 704 288 688 288
WIRE 832 288 832 -32
WIRE 848 288 832 288
WIRE 976 288 976 128
WIRE 992 288 976 288
WIRE 448 320 448 80
WIRE 608 320 608 304
WIRE 608 320 448 320
WIRE 752 320 752 304
WIRE 752 320 608 320
WIRE 896 320 896 304
WIRE 896 320 752 320
WIRE 1040 320 1040 304
WIRE 1040 320 896 320
WIRE 896 352 896 320
FLAG 896 352 0
FLAG 1184 192 OUT
IOPIN 1184 192 Out
FLAG 208 -688 V+
IOPIN 208 -688 In
FLAG 208 -544 InA
IOPIN 208 -544 In
FLAG 208 -288 InB
IOPIN 208 -288 In
FLAG 208 -32 InC
IOPIN 208 -32 In
FLAG 208 128 InD
IOPIN 208 128 In
SYMBOL pmos 992 176 M180
SYMATTR InstName M9
SYMBOL pmos 848 16 M180
SYMATTR InstName M1
SYMBOL pmos 704 -240 M180
SYMATTR InstName M3
SYMBOL pmos 560 -496 M180
SYMATTR InstName M5
SYMBOL nmos 704 208 R0
SYMATTR InstName M7
SYMBOL nmos 992 208 R0
SYMATTR InstName M10
SYMBOL nmos 848 208 R0
SYMATTR InstName M11
SYMBOL nmos 560 208 R0
SYMATTR InstName M12
SYMBOL Config 512 -688 R0
SYMATTR InstName X1
SYMBOL pmos 304 -560 M180
SYMATTR InstName M2
SYMBOL nmos 304 -528 R0
SYMATTR InstName M4
SYMBOL pmos 304 -304 M180
SYMATTR InstName M6
SYMBOL nmos 304 -272 R0
SYMATTR InstName M8
SYMBOL pmos 304 -48 M180
SYMATTR InstName M13
SYMBOL nmos 304 -16 R0
SYMATTR InstName M14

2-in-lut-11.asc, the sub-circuit schematic file:
Version 4
SHEET 1 1660 728
WIRE 432 -688 208 -688
WIRE 464 -688 432 -688
WIRE 608 -688 576 -688
WIRE 432 -656 432 -688
WIRE 432 -656 352 -656
WIRE 304 -640 288 -640
WIRE 608 -592 608 -688
WIRE 560 -576 544 -576
WIRE 288 -544 288 -640
WIRE 288 -544 208 -544
WIRE 352 -544 352 -560
WIRE 544 -544 544 -576
WIRE 544 -544 352 -544
WIRE 352 -528 352 -544
WIRE 288 -448 288 -544
WIRE 304 -448 288 -448
WIRE 448 -432 352 -432
WIRE 608 -416 608 -496
WIRE 752 -416 608 -416
WIRE 432 -400 432 -656
WIRE 432 -400 352 -400
WIRE 304 -384 288 -384
WIRE 752 -336 752 -416
WIRE 704 -320 688 -320
WIRE 288 -288 288 -384
WIRE 288 -288 208 -288
WIRE 352 -288 352 -304
WIRE 688 -288 688 -320
WIRE 688 -288 352 -288
WIRE 352 -272 352 -288
WIRE 288 -192 288 -288
WIRE 304 -192 288 -192
WIRE 448 -176 448 -432
WIRE 448 -176 352 -176
WIRE 752 -176 752 -240
WIRE 752 -176 608 -176
WIRE 896 -176 752 -176
WIRE 608 -160 608 -176
WIRE 752 -160 752 -176
WIRE 544 -80 544 -544
WIRE 560 -80 544 -80
WIRE 688 -80 688 -288
WIRE 704 -80 688 -80
WIRE 448 -48 448 -176
WIRE 608 -48 608 -64
WIRE 608 -48 448 -48
WIRE 752 -48 752 -64
WIRE 752 -48 608 -48
WIRE 608 -16 608 -48
FLAG 896 -176 OUT
IOPIN 896 -176 Out
FLAG 208 -688 V+
IOPIN 208 -688 In
FLAG 208 -544 InA
IOPIN 208 -544 In
FLAG 208 -288 InB
IOPIN 208 -288 In
FLAG 608 -16 0
SYMBOL pmos 704 -240 M180
SYMATTR InstName M3
SYMBOL pmos 560 -496 M180
SYMATTR InstName M5
SYMBOL nmos 704 -160 R0
SYMATTR InstName M7
SYMBOL nmos 560 -160 R0
SYMATTR InstName M12
SYMBOL Config 512 -688 R0
SYMATTR InstName X1
SYMBOL pmos 304 -560 M180
SYMATTR InstName M2
SYMBOL nmos 304 -528 R0
SYMATTR InstName M4
SYMBOL pmos 304 -304 M180
SYMATTR InstName M6
SYMBOL nmos 304 -272 R0
SYMATTR InstName M8

The netlist it stands for:
* LUT-STIM.asc
XX10 IN0 IN1 IN2 IN3 IN4 IN5 IN6 IN7 SEL0 SEL1 SEL2 V+ stim
XX1 SEL2 SEL1 SEL0 IN0 V+ N010 4-in-lut-0000
XX2 SEL2 SEL1 SEL0 IN1 V+ N009 4-in-lut-0010
XX3 SEL2 SEL1 SEL0 IN2 V+ N008 4-in-lut-0100
XX4 SEL2 SEL1 SEL0 IN3 V+ N007 4-in-lut-0110
XX5 SEL2 SEL1 SEL0 IN4 V+ N005 4-in-lut-1000
XX6 SEL2 SEL1 SEL0 IN5 V+ N004 4-in-lut-1010
XX7 SEL2 SEL1 SEL0 IN6 V+ N002 4-in-lut-1100
XX8 SEL2 SEL1 SEL0 IN7 V+ N001 4-in-lut-1110
XX9 N007 N008 N009 N010 V+ N006 4-in-lut-0000
XX11 N001 N002 N004 N005 V+ N003 4-in-lut-0000
XX12 N003 N006 V+ OUT 2-in-lut-11

* block symbol definitions
.subckt stim OUT0 OUT1 OUT2 OUT3 OUT4 OUT5 OUT6 OUT7 SEL0 SEL1 SEL2 V+
V1 V+ 0 1
V2 OUT7 0 PULSE(0 1 5u 0 0 300n 600n 0)
V3 OUT6 0 PULSE(0 1 5u 0 0 250n 500n 0)
V4 OUT5 0 PULSE(0 1 5u 0 0 200n 400n 0)
V5 OUT4 0 PULSE(0 1 5u 0 0 175n 350n 0)
V6 OUT3 0 PULSE(0 1 5u 0 0 150n 300n 0)
V7 OUT2 0 PULSE(0 1 5u 0 0 125n 250n 0)
V8 OUT1 0 PULSE(0 1 5u 0 0 100n 200n 0)
V9 OUT0 0 PULSE(0 1 5u 0 0 80n 160n 0)
V10 N001 0 PULSE(0 1 6u 0 0 2u 4u 0)
XX2 N001 SEL0 SEL1 SEL2 div
.ends stim

.subckt div CLK OUT2 OUT4 OUT8
A1 N003 0 CLK 0 0 N003 OUT2 0 DFLOP
A2 N002 0 OUT2 0 0 N002 OUT4 0 DFLOP
A3 N001 0 OUT4 0 0 N001 OUT8 0 DFLOP
.ends div

.subckt 4-in-lut-0000 InA InB InC InD V+ OUT
M9 OUT InD N004 N004 PMOS
M1 N004 InC N003 N003 PMOS
M3 N003 InB N002 N002 PMOS
M5 N002 InA N001 N001 PMOS
M7 OUT InB 0 0 NMOS
M10 OUT InD 0 0 NMOS
M11 OUT InC 0 0 NMOS
M12 OUT InA 0 0 NMOS
XX1 V+ N001 config
.ends 4-in-lut-0000

.subckt config IN OUT
S1 IN OUT IN 0 MYSW
.model MYSW SW(Ron=1 Roff=10Meg Vt=.5 Vh=.01)
.ends config

.subckt 4-in-lut-0010 InA InB InC InD V+ OUT
M9 OUT InD N005 N005 PMOS
M1 N005 N004 N003 N003 PMOS
M3 N003 InB N002 N002 PMOS
M5 N002 InA N001 N001 PMOS
M7 OUT InB 0 0 NMOS
M10 OUT InD 0 0 NMOS
M11 OUT N004 0 0 NMOS
M12 OUT InA 0 0 NMOS
XX1 V+ N001 config
M13 N004 InC V+ V+ PMOS
M14 N004 InC 0 0 NMOS
.ends 4-in-lut-0010

.subckt 4-in-lut-0100 InA InB InC InD V+ OUT
M9 OUT InD N005 N005 PMOS
M1 N005 InC N004 N004 PMOS
M3 N004 N003 N002 N002 PMOS
M5 N002 InA N001 N001 PMOS
M7 OUT N003 0 0 NMOS
M10 OUT InD 0 0 NMOS
M11 OUT InC 0 0 NMOS
M12 OUT InA 0 0 NMOS
XX1 V+ N001 config
M6 N003 InB V+ V+ PMOS
M8 N003 InB 0 0 NMOS
.ends 4-in-lut-0100

.subckt 4-in-lut-0110 InA InB InC InD V+ OUT
M9 OUT InD N006 N006 PMOS
M1 N006 N005 N004 N004 PMOS
M3 N004 N003 N002 N002 PMOS
M5 N002 InA N001 N001 PMOS
M7 OUT N003 0 0 NMOS
M10 OUT InD 0 0 NMOS
M11 OUT N005 0 0 NMOS
M12 OUT InA 0 0 NMOS
XX1 V+ N001 config
M6 N003 InB V+ V+ PMOS
M8 N003 InB 0 0 NMOS
M13 N005 InC V+ V+ PMOS
M14 N005 InC 0 0 NMOS
.ends 4-in-lut-0110

.subckt 4-in-lut-1000 InA InB InC InD V+ OUT
M9 OUT InD N005 N005 PMOS
M1 N005 InC N004 N004 PMOS
M3 N004 InB N003 N003 PMOS
M5 N003 N002 N001 N001 PMOS
M7 OUT InB 0 0 NMOS
M10 OUT InD 0 0 NMOS
M11 OUT InC 0 0 NMOS
M12 OUT N002 0 0 NMOS
XX1 V+ N001 config
M2 N002 InA V+ V+ PMOS
M4 N002 InA 0 0 NMOS
.ends 4-in-lut-1000

.subckt 4-in-lut-1010 InA InB InC InD V+ OUT
M9 OUT InD N006 N006 PMOS
M1 N006 N005 N004 N004 PMOS
M3 N004 InB N003 N003 PMOS
M5 N003 N002 N001 N001 PMOS
M7 OUT InB 0 0 NMOS
M10 OUT InD 0 0 NMOS
M11 OUT N005 0 0 NMOS
M12 OUT N002 0 0 NMOS
XX1 V+ N001 config
M2 N002 InA V+ V+ PMOS
M4 N002 InA 0 0 NMOS
M13 N005 InC V+ V+ PMOS
M14 N005 InC 0 0 NMOS
.ends 4-in-lut-1010

.subckt 4-in-lut-1100 InA InB InC InD V+ OUT
M9 OUT InD N006 N006 PMOS
M1 N006 InC N005 N005 PMOS
M3 N005 N004 N003 N003 PMOS
M5 N003 N002 N001 N001 PMOS
M7 OUT N004 0 0 NMOS
M10 OUT InD 0 0 NMOS
M11 OUT InC 0 0 NMOS
M12 OUT N002 0 0 NMOS
XX1 V+ N001 config
M2 N002 InA V+ V+ PMOS
M4 N002 InA 0 0 NMOS
M6 N004 InB V+ V+ PMOS
M8 N004 InB 0 0 NMOS
.ends 4-in-lut-1100

.subckt 4-in-lut-1110 InA InB InC InD V+ OUT
M9 OUT InD N007 N007 PMOS
M1 N007 N006 N005 N005 PMOS
M3 N005 N004 N003 N003 PMOS
M5 N003 N002 N001 N001 PMOS
M7 OUT N004 0 0 NMOS
M10 OUT InD 0 0 NMOS
M11 OUT N006 0 0 NMOS
M12 OUT N002 0 0 NMOS
XX1 V+ N001 config
M2 N002 InA V+ V+ PMOS
M4 N002 InA 0 0 NMOS
M6 N004 InB V+ V+ PMOS
M8 N004 InB 0 0 NMOS
M13 N006 InC V+ V+ PMOS
M14 N006 InC 0 0 NMOS
.ends 4-in-lut-1110

.subckt 2-in-lut-11 InA InB V+ OUT
M3 OUT N004 N003 N003 PMOS
M5 N003 N002 N001 N001 PMOS
M7 OUT N004 0 0 NMOS
M12 OUT N002 0 0 NMOS
XX1 V+ N001 config
M2 N002 InA V+ V+ PMOS
M4 N002 InA 0 0 NMOS
M6 N004 InB V+ V+ PMOS
M8 N004 InB 0 0 NMOS
.ends 2-in-lut-11

.model NMOS NMOS
.model PMOS PMOS
.lib standard.mos
.tran 0 75u 0
.backanno
.end